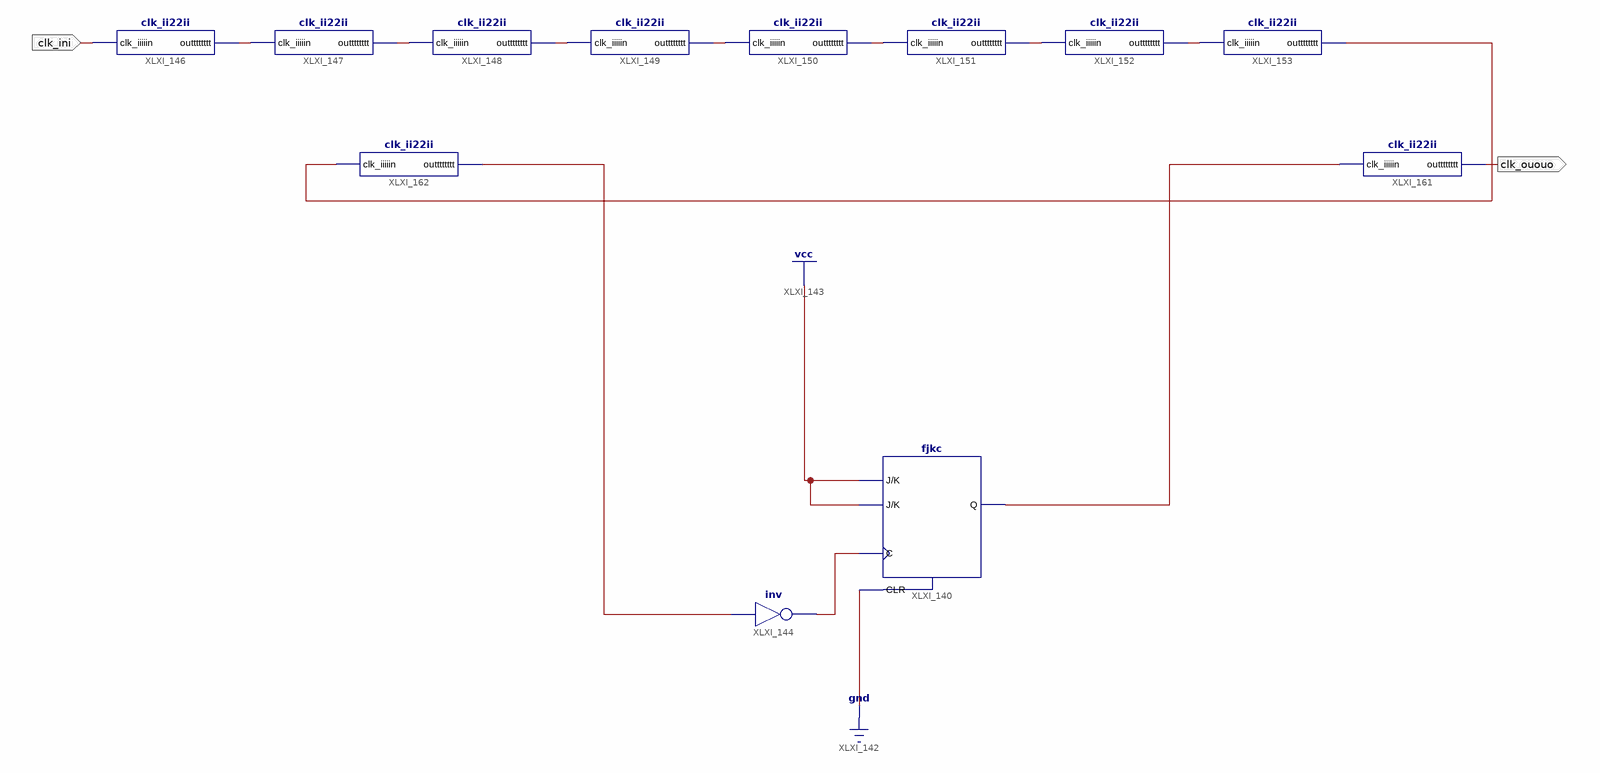
[diagram p0: schematic sheet 1]
// Xilinx ISE schematic clk_idk.sch (spartan6) as structural Verilog: 12 symbols, 2 ports
module clk_idk (
  input  clk_ini,
  output clk_ououo
);

  wire XLXN_190, XLXN_227, XLXN_228, XLXN_229, XLXN_230, XLXN_231, XLXN_232, XLXN_233, XLXN_252, XLXN_255,
       XLXN_256;

  clk_ii22ii XLXI_146 (.clk_iiiiin(clk_ini), .outttttttt(XLXN_227));
  clk_ii22ii XLXI_147 (.clk_iiiiin(XLXN_227), .outttttttt(XLXN_228));
  clk_ii22ii XLXI_148 (.clk_iiiiin(XLXN_228), .outttttttt(XLXN_229));
  clk_ii22ii XLXI_149 (.clk_iiiiin(XLXN_229), .outttttttt(XLXN_230));
  clk_ii22ii XLXI_150 (.clk_iiiiin(XLXN_230), .outttttttt(XLXN_231));
  clk_ii22ii XLXI_151 (.clk_iiiiin(XLXN_231), .outttttttt(XLXN_232));
  clk_ii22ii XLXI_152 (.clk_iiiiin(XLXN_232), .outttttttt(XLXN_233));
  clk_ii22ii XLXI_153 (.clk_iiiiin(XLXN_233), .outttttttt(XLXN_255));
  clk_ii22ii XLXI_161 (.clk_iiiiin(XLXN_252), .outttttttt(clk_ououo));
  fjkc XLXI_140 (.C(XLXN_190), .CLR(1'b0), .J(1'b1), .K(1'b1), .Q(XLXN_252));
  not XLXI_144 (XLXN_190, XLXN_256);
  clk_ii22ii XLXI_162 (.clk_iiiiin(XLXN_255), .outttttttt(XLXN_256));
endmodule
